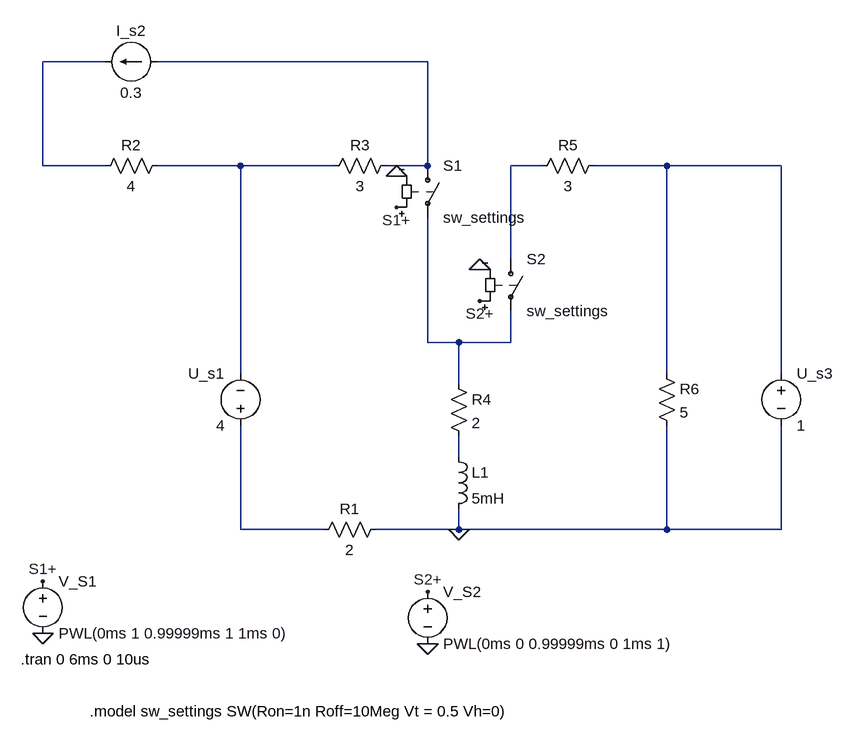
[diagram p0: schematic Assignment3.asc]
Assignment3.asc, the LTspice schematic file:
Version 4
SHEET 1 880 744
WIRE -480 -272 -576 -272
WIRE 16 -272 -400 -272
WIRE -576 -112 -576 -272
WIRE -480 -112 -576 -112
WIRE -272 -112 -400 -112
WIRE -128 -112 -272 -112
WIRE 16 -112 16 -272
WIRE 16 -112 -48 -112
WIRE 192 -112 144 -112
WIRE 384 -112 272 -112
WIRE 560 -112 384 -112
WIRE 144 32 144 -112
WIRE 16 160 16 -32
WIRE 64 160 16 160
WIRE 144 160 144 112
WIRE 144 160 64 160
WIRE -272 208 -272 -112
WIRE 384 208 384 -112
WIRE 560 208 560 -112
WIRE 64 224 64 160
WIRE 64 336 64 304
WIRE -272 448 -272 288
WIRE -144 448 -272 448
WIRE 64 448 64 416
WIRE 64 448 -64 448
WIRE 384 448 384 288
WIRE 384 448 64 448
WIRE 560 448 560 288
WIRE 560 448 384 448
FLAG 64 448 0
FLAG -576 608 0
FLAG -32 -96 0
FLAG 96 48 0
FLAG -576 528 S1+
FLAG -32 -48 S1+
FLAG 16 544 S2+
FLAG 96 96 S2+
FLAG 16 624 0
SYMBOL res -48 432 R90
WINDOW 0 0 56 VBottom 2
WINDOW 3 32 56 VTop 2
SYMATTR InstName R1
SYMATTR Value 2
SYMBOL res -384 -128 R90
WINDOW 0 0 56 VBottom 2
WINDOW 3 32 56 VTop 2
SYMATTR InstName R2
SYMATTR Value 4
SYMBOL res -32 -128 R90
WINDOW 0 0 56 VBottom 2
WINDOW 3 32 56 VTop 2
SYMATTR InstName R3
SYMATTR Value 3
SYMBOL res 48 208 R0
SYMATTR InstName R4
SYMATTR Value 2
SYMBOL res 176 -96 R270
WINDOW 0 32 56 VTop 2
WINDOW 3 0 56 VBottom 2
SYMATTR InstName R5
SYMATTR Value 3
SYMBOL res 368 192 R0
SYMATTR InstName R6
SYMATTR Value 5
SYMBOL ind 48 320 R0
SYMATTR InstName L1
SYMATTR Value 5mH
SYMBOL current -400 -272 R90
WINDOW 0 -32 40 VBottom 2
WINDOW 3 32 40 VTop 2
WINDOW 123 0 0 Left 0
WINDOW 39 0 0 Left 0
SYMATTR InstName I_s2
SYMATTR Value 0.3
SYMBOL voltage 560 192 R0
WINDOW 123 0 0 Left 0
WINDOW 39 0 0 Left 0
SYMATTR InstName U_s3
SYMATTR Value 1
SYMBOL voltage -272 304 R180
WINDOW 0 24 96 Left 2
WINDOW 3 24 16 Left 2
WINDOW 123 0 0 Left 0
WINDOW 39 0 0 Left 0
SYMATTR InstName U_s1
SYMATTR Value 4
SYMBOL sw 16 -128 R0
SYMATTR InstName S1
SYMATTR Value sw_settings
SYMBOL sw 144 16 R0
SYMATTR InstName S2
SYMATTR Value sw_settings
SYMBOL voltage -576 512 R0
WINDOW 123 0 0 Left 0
WINDOW 39 0 0 Left 0
SYMATTR InstName V_S1
SYMATTR Value PWL(0ms 1 0.99999ms 1 1ms 0)
SYMBOL voltage 16 528 R0
WINDOW 123 0 0 Left 0
WINDOW 39 0 0 Left 0
SYMATTR InstName V_S2
SYMATTR Value PWL(0ms 0 0.99999ms 0 1ms 1)
TEXT -610 648 Left 2 !.tran 0 6ms 0 10us
TEXT -504 728 Left 2 !.model sw_settings SW(Ron=1n Roff=10Meg Vt = 0.5 Vh=0)

The netlist it stands for:
* Assignment3.asc
R1 0 N008 2
R2 N003 N001 4
R3 N002 N003 3
R4 N006 N007 2
R5 N004 N005 3
R6 N005 0 5
L1 N007 0 5mH
I_s2 N002 N001 0.3
V§U_s3 N005 0 1
V§U_s1 N008 N003 4
S1 N002 N006 S1+ 0 sw_settings
S2 N004 N006 S2+ 0 sw_settings
V_S1 S1+ 0 PWL(0ms 1 0.99999ms 1 1ms 0)
V_S2 S2+ 0 PWL(0ms 0 0.99999ms 0 1ms 1)
.tran 0 6ms 0 10us
.model sw_settings SW(Ron=1n Roff=10Meg Vt = 0.5 Vh=0)
.backanno
.end